# EAGLE design micromouse (EAGLE 9.6.2)
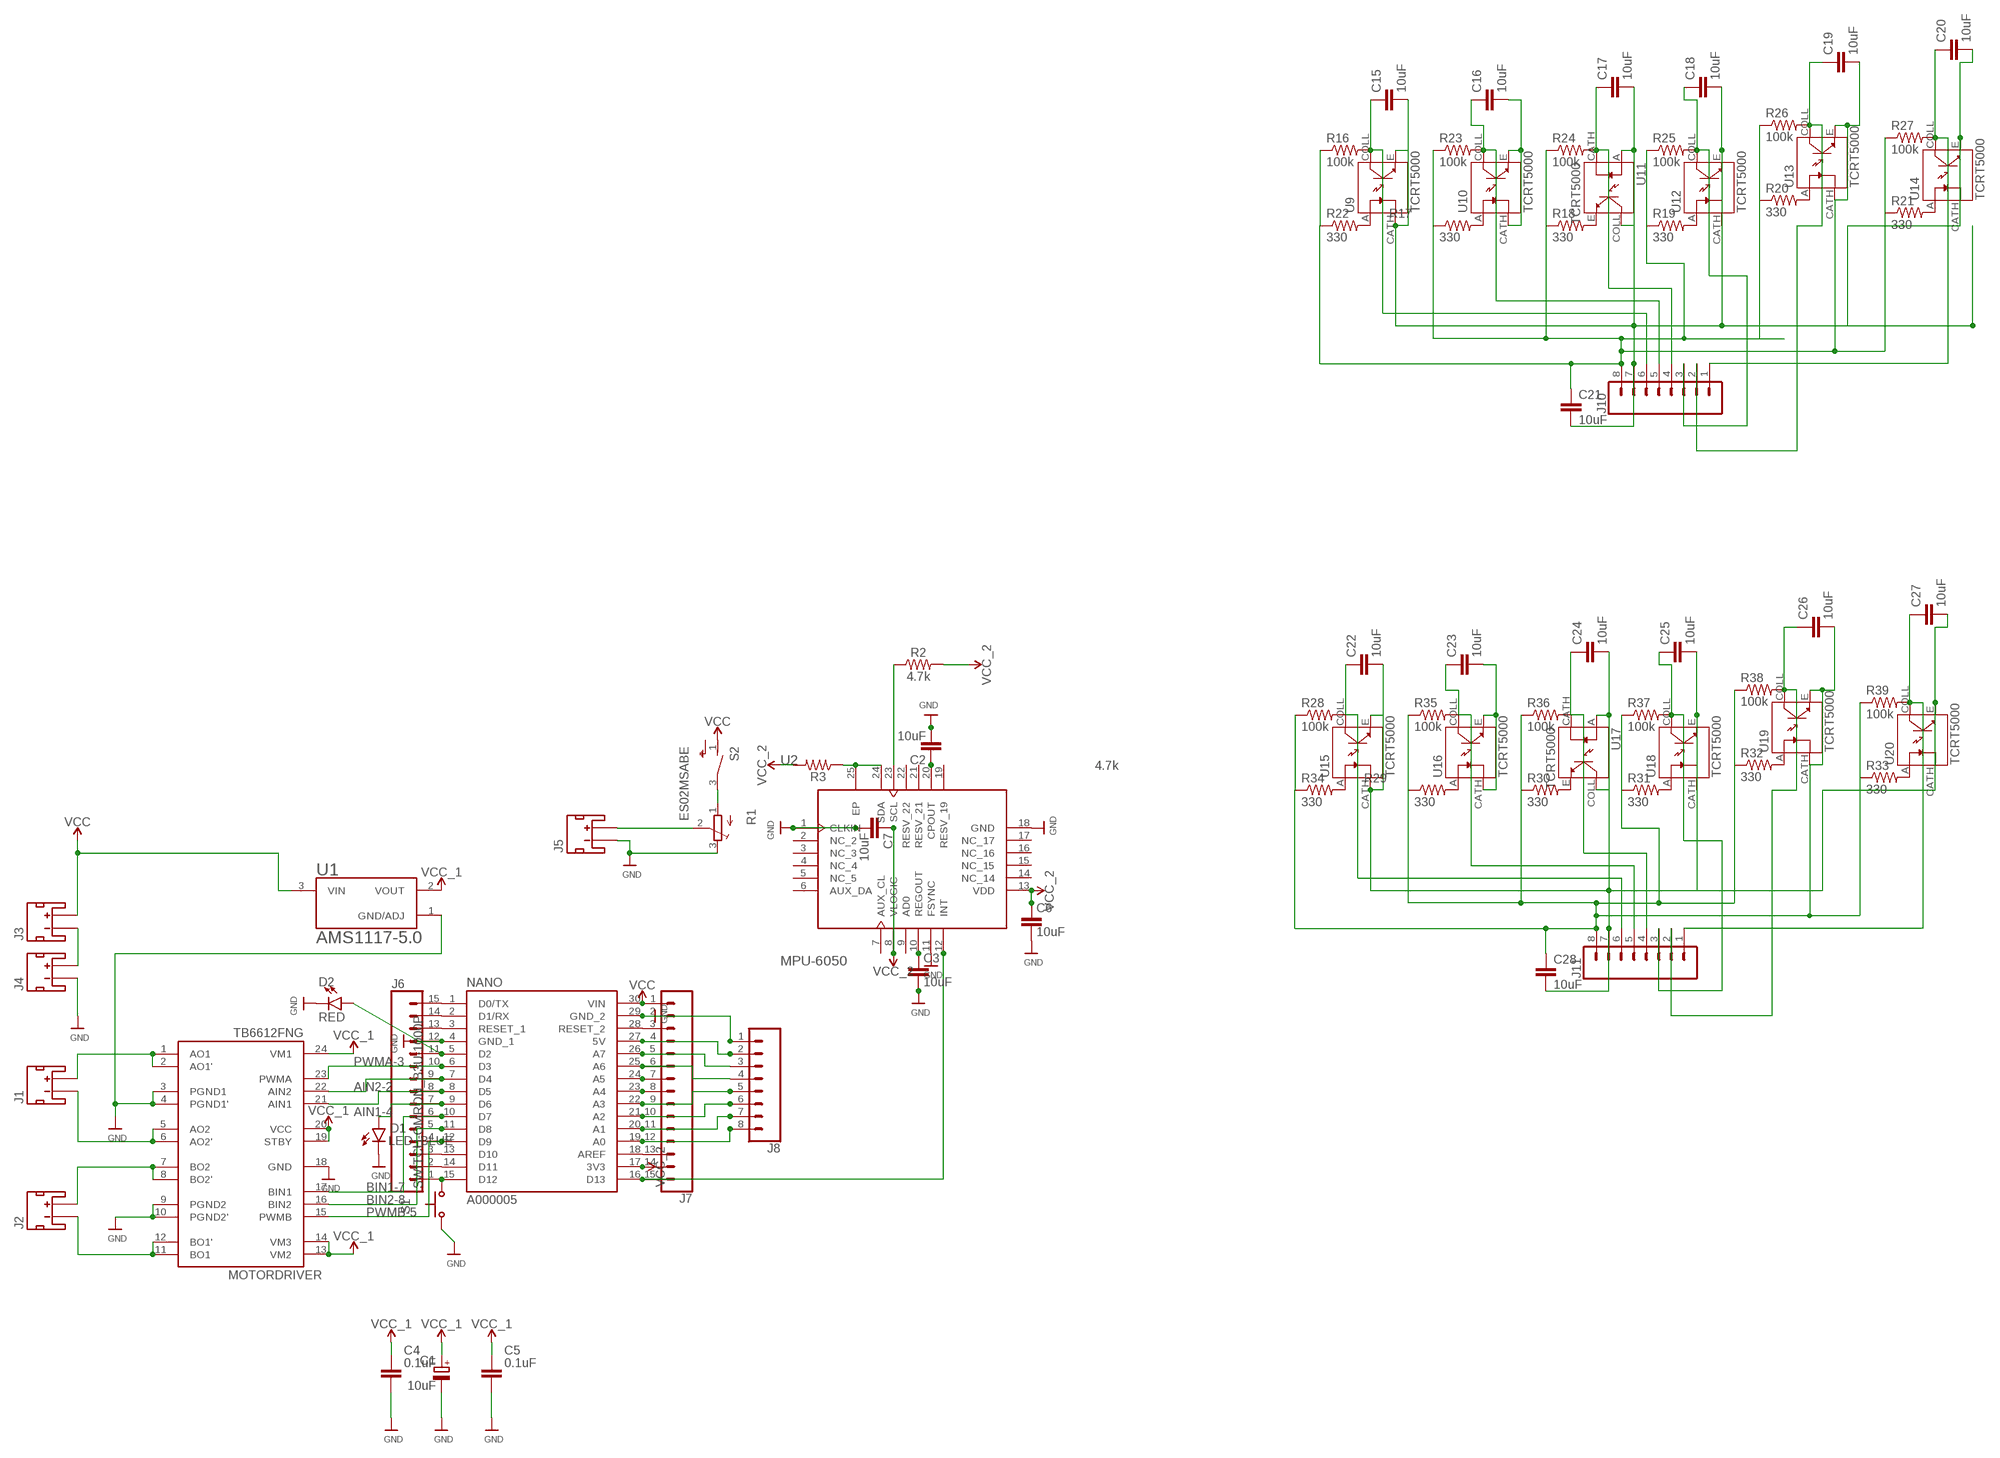
[diagram p0: schematic, sheet 1]

## Parts
C1  10uF  C-POL_TANTALUM-2917(7343-METRIC)  [CAPMP7343X310N]
C2  10uF  C0603C180J5GACTU  [CAP_0603]
C3  10uF  C0603C180J5GACTU  [CAP_0603]
C4  0.1uF  C_CHIP-1206(3216-METRIC)  [CAPC3216X135]
C5  0.1uF  C_CHIP-1206(3216-METRIC)  [CAPC3216X135]
C6  10uF  C0603C180J5GACTU  [CAP_0603]
C7  10uF  C0603C180J5GACTU  [CAP_0603]
C15  10uF  10UF-0603-6.3V-20%  [0603]
C16  10uF  10UF-0603-6.3V-20%  [0603]
C17  10uF  10UF-0603-6.3V-20%  [0603]
C18  10uF  10UF-0603-6.3V-20%  [0603]
C19  10uF  10UF-0603-6.3V-20%  [0603]
C20  10uF  10UF-0603-6.3V-20%  [0603]
C21  10uF  10UF-0603-6.3V-20%  [0603]
C22  10uF  10UF-0603-6.3V-20%  [0603]
C23  10uF  10UF-0603-6.3V-20%  [0603]
C24  10uF  10UF-0603-6.3V-20%  [0603]
C25  10uF  10UF-0603-6.3V-20%  [0603]
C26  10uF  10UF-0603-6.3V-20%  [0603]
C27  10uF  10UF-0603-6.3V-20%  [0603]
C28  10uF  10UF-0603-6.3V-20%  [0603]
D1  LED_BLUE  LED_CHIP_BLUE-1608  [LEDC1608X39N_B]
D2  RED  LED-RED1206  [LED-1206]
J1  JST_2MM_MALE  [JST-2-SMD]
J2  JST_2MM_MALE  [JST-2-SMD]
J3  JST_2MM_MALE  [JST-2-SMD]
J4  JST_2MM_MALE  [JST-2-SMD]
J5  JST_2MM_MALE  [JST-2-SMD]
J6  CONN_15LOCK  [1X15_LOCK]
J7  CONN_15LOCK  [1X15_LOCK]
J8  CONN_08NO_SILK_FEMALE_PTH  [1X08_NO_SILK]
J10  CONN_08NO_SILK_FEMALE_PTH  [1X08_NO_SILK]
J11  CONN_08NO_SILK_FEMALE_PTH  [1X08_NO_SILK]
MOTORDRIVER  TB6612FNG  [SSOP24]
NANO  A000005  [MODULE_A000005]
R1  TRIM_EU-3223W  [3223W]
R2  4.7k  4.7KOHM-0603-1/10W-1%  [0603]
R3  4.7k  4.7KOHM-0603-1/10W-1%  [0603]
R16  100k  R-US_R0603  [R0603]
R17  330  R-US_R0603  [R0603]
R18  330  R-US_R0603  [R0603]
R19  330  R-US_R0603  [R0603]
R20  330  R-US_R0603  [R0603]
R21  330  R-US_R0603  [R0603]
R22  330  R-US_R0603  [R0603]
R23  100k  R-US_R0603  [R0603]
R24  100k  R-US_R0603  [R0603]
R25  100k  R-US_MELF0207R  [MINI_MELF-0207R]
R26  100k  R-US_R0603  [R0603]
R27  100k  R-US_R0603  [R0603]
R28  100k  RESISTOR0603  [R0603]
R29  330  RESISTOR0603  [R0603]
R30  330  RESISTOR0603  [R0603]
R31  330  RESISTOR0603  [R0603]
R32  330  RESISTOR0603  [R0603]
R33  330  RESISTOR0603  [R0603]
R34  330  RESISTOR0603  [R0603]
R35  100k  RESISTOR0603  [R0603]
R36  100k  RESISTOR0603  [R0603]
R37  100k  RESISTOR0603  [R0603]
R38  100k  RESISTOR0603  [R0603]
R39  100k  RESISTOR0603  [R0603]
S1  SWITCH-OMRON_B3U-1000P  [SWITCH-OMRON_B3U-1000P]
S2  ES02MSABE  [ES02MSABE]
U1  AMS1117-5.0  [SOT229P700X180-4N]
U2  MPU-6050  [24-VFQFN]
U9  TCRT5000  [OPTO_TCRT5000]
U10  TCRT5000  [OPTO_TCRT5000]
U11  TCRT5000  [OPTO_TCRT5000]
U12  TCRT5000  [OPTO_TCRT5000]
U13  TCRT5000  [OPTO_TCRT5000]
U14  TCRT5000  [OPTO_TCRT5000]
U15  TCRT5000  [OPTO_TCRT5000]
U16  TCRT5000  [OPTO_TCRT5000]
U17  TCRT5000  [OPTO_TCRT5000]
U18  TCRT5000  [OPTO_TCRT5000]
U19  TCRT5000  [OPTO_TCRT5000]
U20  TCRT5000  [OPTO_TCRT5000]

## Nets
AIN1-4: J6.8 MOTORDRIVER.21(AIN1) NANO.8(D5)
AIN2-2: J6.9 MOTORDRIVER.22(AIN2) NANO.7(D4)
BIN1-7: J6.6 MOTORDRIVER.17(BIN1) NANO.10(D7)
BIN2-8: J6.5 MOTORDRIVER.16(BIN2) NANO.11(D8)
GND: C1.2(-) C2.2 C3.2 C4.2 C5.2 C6.2 C7.2 D1.1(C) D2.C J4.1(-) J5.1(-) J6.12 J7.2 J8.1 MOTORDRIVER.3(PGND1) MOTORDRIVER.4(PGND1') MOTORDRIVER.9(PGND2) MOTORDRIVER.10(PGND2') MOTORDRIVER.18(GND) NANO.4(GND_1) NANO.29(GND_2) R1.3(E) S1.1(P) U1.1(GND/ADJ) U2.1(CLKIN) U2.11(FSYNC) U2.18(GND)
N$1: J1.2(+) MOTORDRIVER.1(AO1) MOTORDRIVER.2(AO1')
N$2: J7.5 J8.3 NANO.26(A7)
N$3: J1.1(-) MOTORDRIVER.5(AO2) MOTORDRIVER.6(AO2')
N$4: J2.2(+) MOTORDRIVER.7(BO2) MOTORDRIVER.8(BO2')
N$5: J7.4 J8.2 NANO.27(5V)
N$6: J2.1(-) MOTORDRIVER.11(BO1) MOTORDRIVER.12(BO1')
N$7: J7.12 J8.8 NANO.19(A0)
N$8: J7.11 J8.7 NANO.20(A1)
N$9: J7.10 J8.6 NANO.21(A2)
N$10: J7.9 J8.5 NANO.22(A3)
N$11: R3.1 U2.24(SDA) U2.25(EP)
N$12: R2.1 U2.23(SCL)
N$13: R1.1(A) S2.3
N$14: D2.A J6.11 NANO.5(D2)
N$15: J5.2(+) R1.2(S)
N$16: J6.1 NANO.15(D12) S1.2(S)
N$18: J3.1(-) J4.2(+)
N$19: J6.3 NANO.13(D10)
N$20: D1.2(A) J6.7 NANO.9(D6)
N$21: J6.13 NANO.3(RESET_1)
N$22: J6.14 NANO.2(D1/RX)
N$23: J6.15 NANO.1(D0/TX)
N$24: J7.3 NANO.28(RESET_2)
N$25: J6.2 NANO.14(D11)
N$26: J7.6 J8.4 NANO.25(A6)
N$27: J7.13 NANO.18(AREF)
N$29: J7.15 NANO.16(D13) U2.12(INT)
N$30: J7.8 NANO.23(A4)
N$31: J7.7 NANO.24(A5)
N$34: C2.1 U2.20(CPOUT)
N$35: C3.1 U2.10(REGOUT)
N$47: C16.1 J10.5 R23.2 U10.COLL
N$48: C17.1 J10.4 R24.2 U11.CATH
N$49: C20.1 J10.1 R27.2 U14.COLL
N$50: C19.1 J10.2 R26.2 U13.COLL
N$51: C18.1 J10.3 R25.2 U12.COLL
N$52: R22.2 U9.A
N$53: R17.2 U10.A
N$54: C19.2 C21.1 J10.8 R16.1 R17.1 R18.1 R19.1 R20.1 R21.1 R22.1 R23.1 R24.1 R25.1 R26.1 R27.1 U13.CATH U13.E
N$55: R18.2 U11.E
N$56: C15.2 C17.2 C18.2 C20.2 C21.2 J10.7 U9.CATH U9.E U11.A U11.COLL U12.CATH U12.E U14.CATH U14.E
N$57: C16.2 U10.CATH U10.E
N$58: C15.1 J10.6 R16.2 U9.COLL
N$59: R19.2 U12.A
N$60: R20.2 U13.A
N$61: R21.2 U14.A
N$62: C23.1 J11.5 R35.2 U16.COLL
N$63: C24.1 J11.4 R36.2 U17.CATH
N$64: C27.1 J11.1 R39.2 U20.COLL
N$65: C26.1 J11.2 R38.2 U19.COLL
N$66: C25.1 J11.3 R37.2 U18.COLL
N$67: R34.2 U15.A
N$68: R29.2 U16.A
N$69: C26.2 C28.1 J11.8 R28.1 R29.1 R30.1 R31.1 R32.1 R33.1 R34.1 R35.1 R36.1 R37.1 R38.1 R39.1 U19.CATH U19.E
N$70: R30.2 U17.E
N$71: C22.2 C24.2 C25.2 C27.2 C28.2 J11.7 U15.CATH U15.E U17.A U17.COLL U18.CATH U18.E U20.CATH U20.E
N$72: C23.2 U16.CATH U16.E
N$73: C22.1 J11.6 R28.2 U15.COLL
N$74: R31.2 U18.A
N$75: R32.2 U19.A
N$76: R33.2 U20.A
PWMA-3: J6.10 MOTORDRIVER.23(PWMA) NANO.6(D3)
PWMB-5: J6.4 MOTORDRIVER.15(PWMB) NANO.12(D9)
VCC: J3.2(+) J7.1 NANO.30(VIN) S2.1 U1.3(VIN)
VCC_1: C1.1(+) C4.1 C5.1 MOTORDRIVER.13(VM2) MOTORDRIVER.14(VM3) MOTORDRIVER.19(STBY) MOTORDRIVER.20(VCC) MOTORDRIVER.24(VM1) U1.2(VOUT)
VCC_2: C6.1 C7.1 J7.14 NANO.17(3V3) R2.2 R3.2 U2.8(VLOGIC) U2.13(VDD)
Unconnected: J1.NC1(PAD1) J1.NC2(PAD2) J2.NC1(PAD1) J2.NC2(PAD2) J3.NC1(PAD1) J3.NC2(PAD2) J4.NC1(PAD1) J4.NC2(PAD2) J5.NC1(PAD1) J5.NC2(PAD2) S2.S1(SH) S2.S2(SH) U2.2(NC_2) U2.3(NC_3) U2.4(NC_4) U2.5(NC_5) U2.6(AUX_DA) U2.7(AUX_CL) U2.9(AD0) U2.14(NC_14) U2.15(NC_15) U2.16(NC_16) U2.17(NC_17) U2.19(RESV_19) U2.21(RESV_21) U2.22(RESV_22)

## Library data of the parts
C1 = Capacitor:C-POL: Capacitor Polarised - Generic; CATEGORY: Capacitor
C2 C3 C6 C7 = Resistor_Capacitor:C0603C180J5GACTU: CAP CER 18PF 50V C0G/NP0 0603 Manufacturer's datasheet; CREATED_BY: PCBLayout.com; DIGIKEY_PART_NUMBER: 399-1052-2-ND; MANUFACTURER: KEMET; MPN: C0603C180J5GACTU; PACKAGE: SMD 0603
C4 C5 = Capacitor:C: Capacitor - Generic; CATEGORY: Capacitor
C15-C28 = SparkFun-Capacitors:10UF: 10.0µF ceramic capacitors A capacitor is a passive two-terminal electrical component used to store electrical energy temporarily in an electric field.; PROD_ID: CAP-11015
D1 = Opto-Electronic:LED_CHIP: LED - Generic; CATEGORY: Opto-Electronic; COLOR: Blue; SUB-CATEGORY: LED
D2 = SparkFun-LED:LED-RED: Red SMD LED Used in manufacturing of most products at SparkFun Packages: 0603 - SMD 0603 package [Product Link] <http://docs.avagotech.com/docs/AV02-0551EN> 0603 SMART - SMD 0603 SMART package ( more efficient and expensive)[Product Link] <http://www.osram-os.com/Graphics/XPic2/00077099_0.pdf> 1206 - SMD1206 package [Product Link] <https://www.sparkfun.com/datasheets/DevTools/LilyPad/Q150OVS4.pdff> SparkFun Products: Pro Mini 328 -5V <https://www.sparkfun.com/products/821> RedBoard <https://www.sparkfun.com/products/12757> IOIO-OTG <https://www.sparkfun.com/products/13613>; PROD_ID: DIO-09912
J1-J5 = SparkFun-Connectors:JST_2MM_MALE: JST 2MM MALE RA CONNECTOR Two pin, compact surface mount connector. Commonly used as a battery input connection point. We really like the solid locking feeling and high current rating on these small connectors. We use these all the time as battery connectors. Mates to single-cell LiPo batteries. Here is the connector we sell at SparkFun: JST Right Angle Connector - White (PRT-08612) Datasheet It was used on these SparkFun products: SparkFun MOSFET Power Controller (PRT-11214) SparkFun Battery Babysitter - LiPo Battery Manager (PRT-13777) And many, many others that required a lipo battery connection.; PROD_ID: CONN-11443; SF_ID: PRT-08612
J6 J7 = SparkFun-Connectors:CONN_15: Multi connection point. Often used as Generic Header-pin footprint for 0.1 inch spaced/style header connections On any of the 0.1 inch spaced packages, you can populate with these: Break Away Headers - Straight (PRT-00116) Break Away Male Headers - Right Angle (PRT-00553) Female Headers (PRT-00115) Break Away Headers - Machine Pin (PRT-00117) Break Away Female Headers - Swiss Machine Pin (PRT-00743) For SCREWTERMINALS and SPRING TERMINALS visit here: Screw Terimnals on SparkFun.com (5mm/3.5mm/2.54mm spacing) This device is also useful as a general connection point to wire up your design to another part of your project. Our various solder wires solder well into these plated through hole pads. Hook-Up Wire - Assortment (Stranded, 22 AWG) (PRT-11375) Hook-Up Wire - Assortment (Solid Core, 22 AWG) (PRT-11367) View the entire wire category on our website here Special notes: Molex polarized connector foot print use with SKU : PRT-08231 with associated crimp pins and housings. 1MM SMD Version SKU: PRT-10208 NOTES ON THE VARIANTS LOCK and LOCK_LONGPADS... This footprint was designed to help hold the alignment of a through-hole component (i.e. 6-pin header) while soldering it into place. You may notice that each hole has been shifted either up or down by 0.005 of an inch from it's more standard position (which is a perfectly straight line). This slight alteration caused the pins (the squares in the middle) to touch the edges of the holes. Because they are alternating, it causes a "brace" to hold the component in place. 0.005 has proven to be the perfect amount of "off-center" position when using our standard breakaway headers. Although looks a little odd when you look at the bare footprint, once you have a header in there, the alteration is very hard to notice. Also,if you push a header all the way into place, it is covered up entirely on the bottom side.
J8 J10 J11 = SparkFun-Connectors:CONN_08: Multi connection point. Often used as Generic Header-pin footprint for 0.1 inch spaced/style header connections On any of the 0.1 inch spaced packages, you can populate with these: Break Away Headers - Straight (PRT-00116) Break Away Male Headers - Right Angle (PRT-00553) Female Headers (PRT-00115) Break Away Headers - Machine Pin (PRT-00117) Break Away Female Headers - Swiss Machine Pin (PRT-00743) Arduino Stackable Header - 8 Pin (PRT-09279) For SCREWTERMINALS and SPRING TERMINALS visit here: Screw Terimnals on SparkFun.com (5mm/3.5mm/2.54mm spacing) This device is also useful as a general connection point to wire up your design to another part of your project. Our various solder wires solder well into these plated through hole pads. Hook-Up Wire - Assortment (Stranded, 22 AWG) (PRT-11375) Hook-Up Wire - Assortment (Solid Core, 22 AWG) (PRT-11367) View the entire wire category on our website here Special notes: Molex polarized connector foot print use with SKU : PRT-08231 with associated crimp pins and housings. 1MM SMD Version SKU: PRT-10208 NOTES ON THE VARIANTS LOCK and LOCK_LONGPADS... This footprint was designed to help hold the alignment of a through-hole component (i.e. 6-pin header) while soldering it into place. You may notice that each hole has been shifted either up or down by 0.005 of an inch from it's more standard position (which is a perfectly straight line). This slight alteration caused the pins (the squares in the middle) to touch the edges of the holes. Because they are alternating, it causes a "brace" to hold the component in place. 0.005 has proven to be the perfect amount of "off-center" position when using our standard breakaway headers. Although looks a little odd when you look at the bare footprint, once you have a header in there, the alteration is very hard to notice. Also,if you push a header all the way into place, it is covered up entirely on the bottom side.; PROD_ID: CONN-08438
MOTORDRIVER = adafruit:TB6612FNG: TB6612FNG MOS dual H-bridge motor driver, 1.2A current 3.2A peak 3 or 5v logic and 3-15v motor
NANO = A000005:A000005: CLOCK SAW OSCILLATOR SEAM7050 T& Check availability; AVAILABILITY: In Stock; CHECK_PRICES: https://www.snapeda.com/parts/A000005/Arduino/view-part/?ref=eda; DESCRIPTION: Small, complete, and breadboard-friendly board based on the ATmega328 (Arduino Nano 3.x).; MF: Arduino; MP: A000005; PACKAGE: Non-Standard Arduino; PRICE: None; PURCHASE-URL: https://pricing.snapeda.com/search?q=A000005&ref=eda; SNAPEDA_LINK: https://www.snapeda.com/parts/A000005/Arduino/view-part/?ref=snap
R1 = pot:TRIM_EU-: POTENTIOMETER
R2 R3 = SparkFun-Resistors:4.7KOHM: 4.7kΩ resistor A resistor is a passive two-terminal electrical component that implements electrical resistance as a circuit element. Resistors act to reduce current flow, and, at the same time, act to lower voltage levels within circuits. - Wikipedia; PROD_ID: RES-07857
R16-R27 = BeagleBone_Black_Wireless:R-US_: RESISTOR, American symbol
R28-R39 = BeagleBone_Blue_R3:RESISTOR
S1 = LinkedLibrary52101:SWITCH-OMRON_B3U-1000P: SMD Tactile Switch - Ultra Small
S2 = Switch:ES02MSABE: SWITCH SLIDE SPST 0.4VA 20V Manufacturer's datasheet; CREATED_BY: PCBLayout.com; DIGIKEY_PARTNO: CKN1813TR-ND; MANUFACTURER: C&K; MPN: ES02MSABE
U1 = AMS1117-5.0:AMS1117-5.0: Check availability; AVAILABILITY: Not in stock; CHECK_PRICES: https://www.snapeda.com/parts/AMS1117-5.0/Advanced+Monolithic+Systems/view-part/?ref=eda; DESCRIPTION: Sot223/Pkg 1-Amp 5-Volt Low Drop Out Voltage Regulatator; MF: Advanced Monolithic Systems; MP: AMS1117-5.0; PACKAGE: SOT-223 Seeed Technology; PRICE: None; SNAPEDA_LINK: https://www.snapeda.com/parts/AMS1117-5.0/Advanced+Monolithic+Systems/view-part/?ref=snap
U2 = Sensor:MPU-6050: IMU ACCEL/GYRO 3-AXIS I2C 24QFN Manufacturer's datasheet; CREATED_BY: PCBLayout.com; DIGIKEY_PART_NUMBER: 1428-1007-1-ND; MANUFACTURER: TDK InvenSense; MPN: MPU-6050; PACKAGE: 24-VFQFN
U9-U20 = TCRT5000:TCRT5000: 950 nm 60 mA Through Hole Reflective Optical Sensor with Transistor Output Check availability; AVAILABILITY: In Stock; CHECK_PRICES: https://www.snapeda.com/parts/TCRT5000/Vishay+Semiconductor+Opto+Division/view-part/?ref=eda; DESCRIPTION: Reflective Optical Sensor 0.591 (15mm) PCB Mount; MF: Vishay; MP: TCRT5000; PACKAGE: TCRT5000 Vishay; PRICE: None; PURCHASE-URL: https://www.snapeda.com/api/url_track_click_mouser/?unipart_id=885229&manufacturer=Vishay&part_name=TCRT5000&search_term=None; SNAPEDA_LINK: https://www.snapeda.com/parts/TCRT5000/Vishay+Semiconductor+Opto+Division/view-part/?ref=snap

## Module BODY
Ports: 

### Library data of the parts

## Board
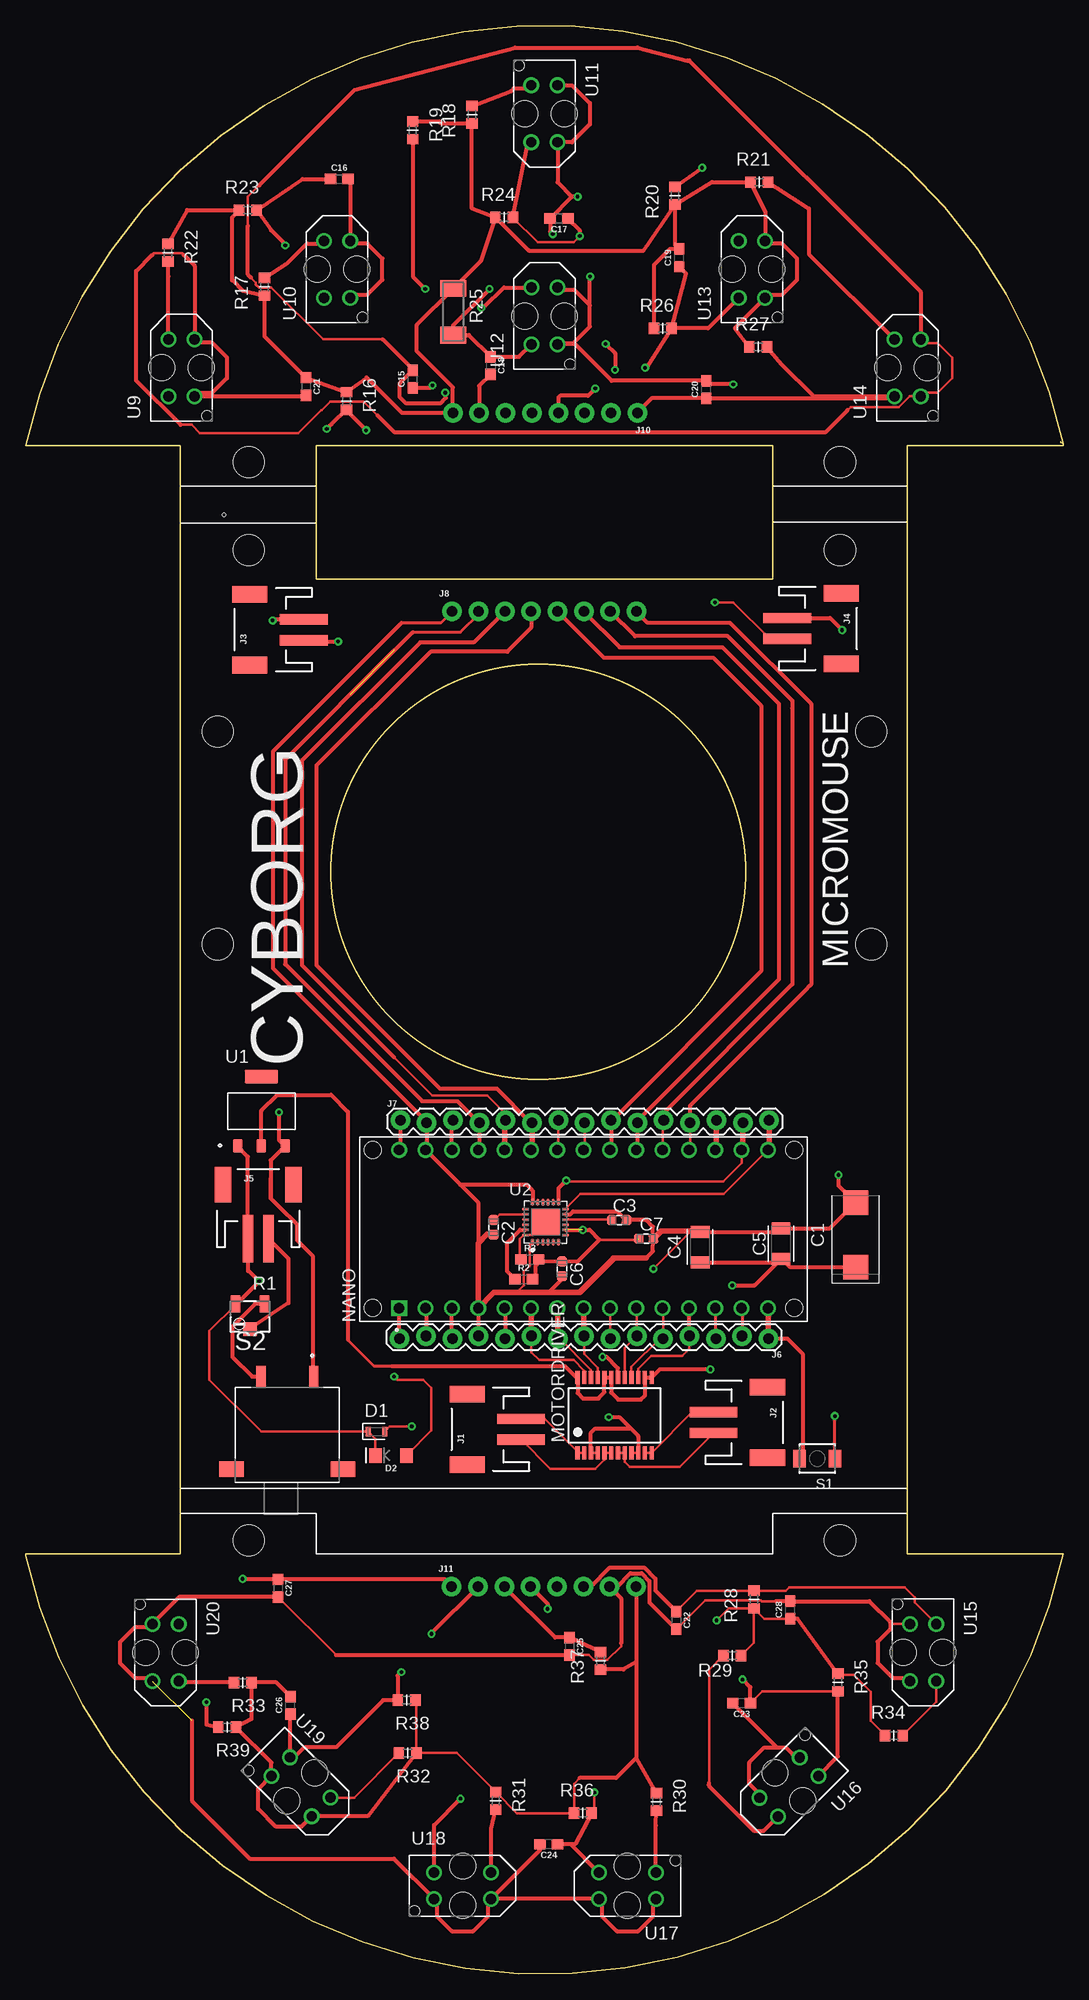
[diagram p1: board, top side]
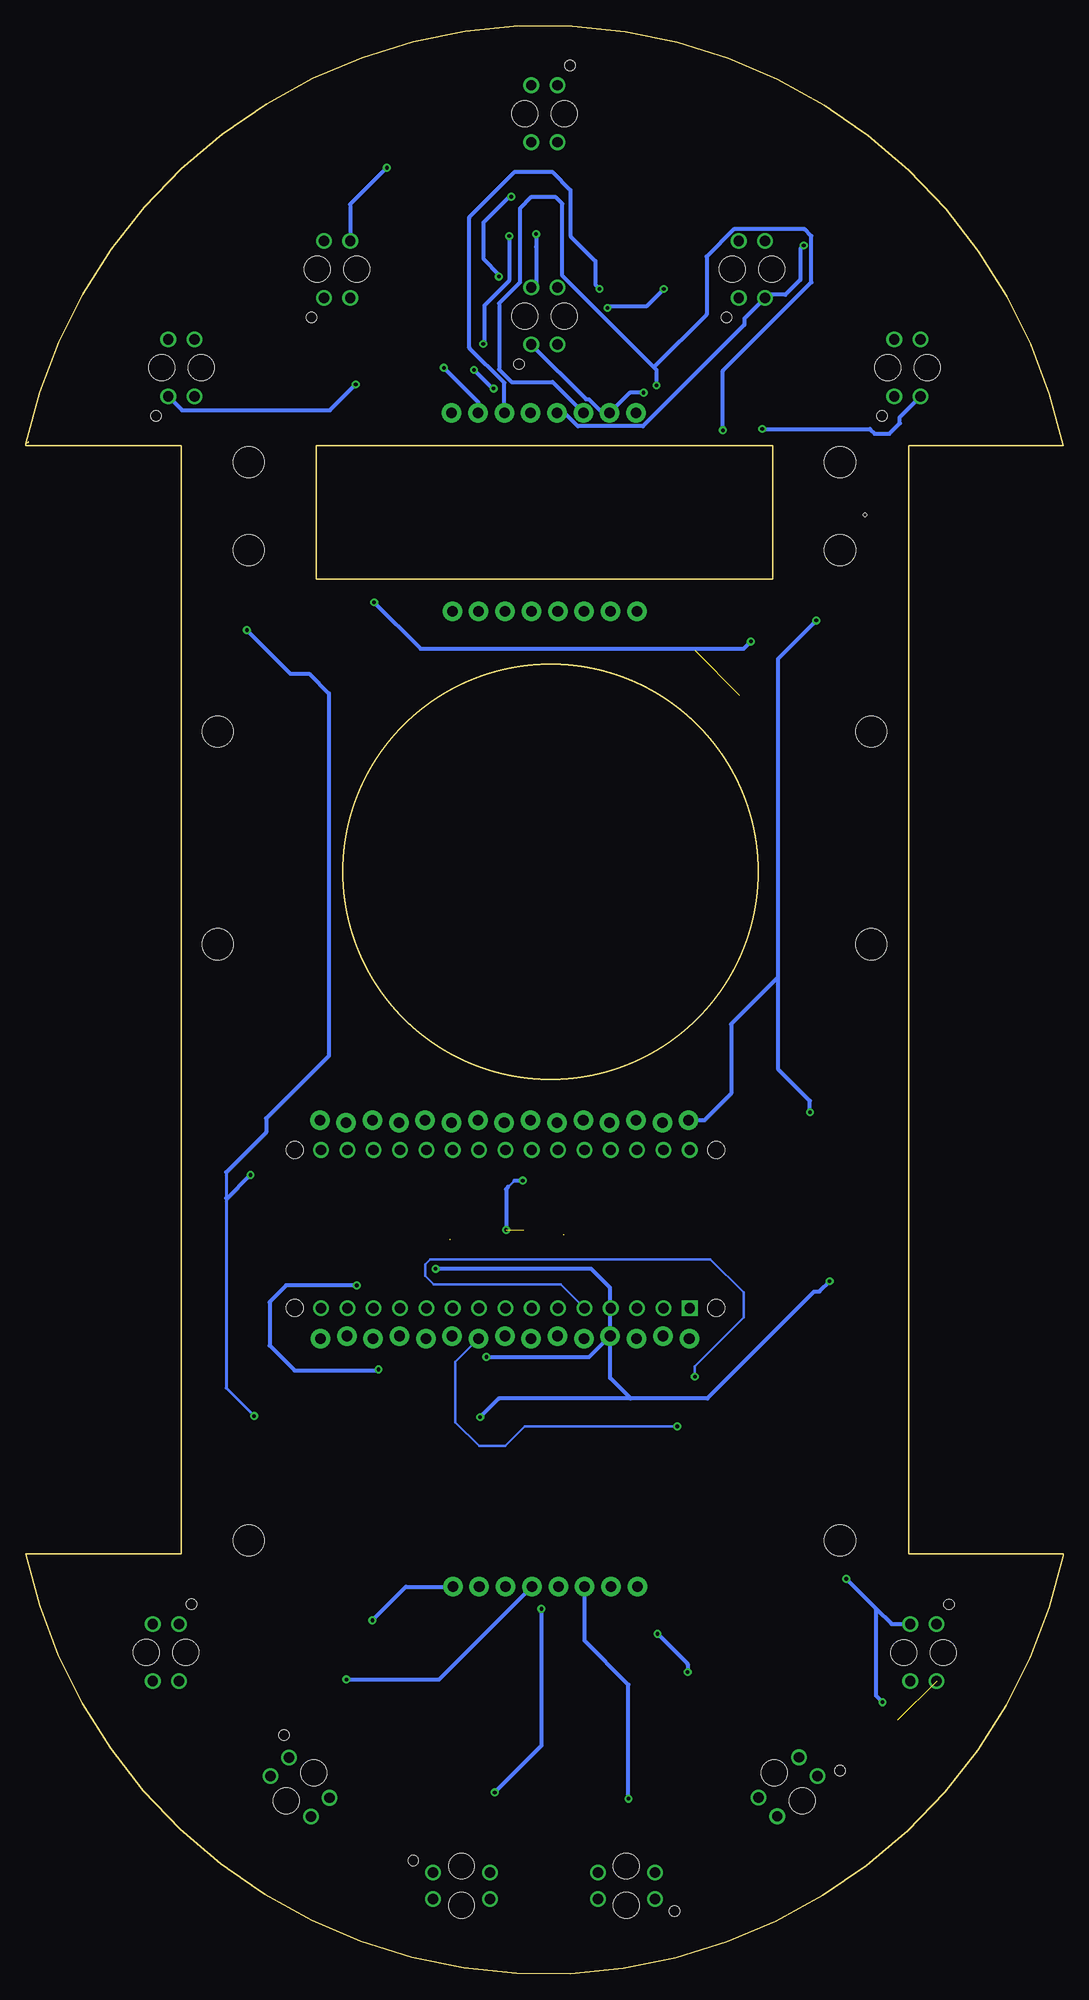
[diagram p2: board, bottom side, seen from below]

Size 100 x 187.84 mm. Coordinates in mm from the lower left corner, seen from the top.
Outline: 100,147.57 100,147.37 85,147.37 85,40.47 100,40.47 arc-156 0,40.27 0,40.47 14.9,40.47 14.9,147.37 0,147.37 arc-156 100,147.57
Outline: 100,147.57 99.8,147.67 99.8,147.77
Outline: 28,134.47 72,134.47 72,147.37 28,147.37 28,134.47
Outline: circle at 49.4,106.27 radius 20
Copper layers (1*16): Top 0.035mm / dielectric 1.5mm / Bottom 0.035mm
Design rules "default": minimum track width 6mil, minimum drill 0.35mm, track to track 6mil, track to pad 6mil, pad to pad 6mil, via to via 6mil, smd to smd 6mil, copper to edge 40mil, drill to drill 6mil, minimum pad ring 10mil, minimum via ring 8mil, stop-mask expansion 4mil, vias tented up to drill 0mil, thermal gap 10mil
Holes 40 mm at 49.4,106.27 49.4,106.27
Holes 3 mm at 18.5,119.77 81.5,119.77 18.5,99.27 81.5,99.27 78.5,137.27 21.5,137.27 21.5,145.77 78.5,145.77 21.5,41.77 78.5,41.77
Holes 0.35 mm at 19.1,140.67

### Footprints (pad centres in the part's own frame; a part is rotated, then mirrored left to right if it is on the bottom)
CAPMP7343X310N = smd 2.368 x 2.404: 1 -3.121,0; 2 3.121,0
CAP_0603 = smd 0.92 x 0.93: 1 -0.705,0; 2 0.705,0
CAPC3216X135 = smd 1.165 x 1.815: 1 -1.475,0; 2 1.475,0
0603 = smd 1.1 x 1: 1 -0.85,0; 2 0.85,0
LEDC1608X39N_B = smd 0.512 x 0.912: 1 -0.8,0; 2 0.8,0
LED-1206 = smd 1.2 x 1.4: A -1.5,0; C 1.5,0
JST-2-SMD = smd 1 x 4.6: 1 -1,-3.7; 2 1,-3.7 | smd 1.6 x 3.4: NC1 -3.4,1.5; NC2 3.4,1.5
1X15_LOCK = drill 1.016 pad 1.88: 1 0,0.127; 2 2.54,-0.127; 3 5.08,0.127; 4 7.62,-0.127; 5 10.16,0.127; 6 12.7,-0.127; 7 15.24,0.127; 8 17.78,-0.127; 9 20.32,0.127; 10 22.86,-0.127; 11 25.4,0.127; 12 27.94,-0.127; 13 30.48,0.127; 14 33.02,-0.127; 15 35.56,0.127
1X08_NO_SILK = drill 1.016 pad 1.88: 1 0,0; 2 2.54,0; 3 5.08,0; 4 7.62,0; 5 10.16,0; 6 12.7,0; 7 15.24,0; 8 17.78,0
SSOP24 = smd 0.4 x 1.25: 1 -3.575,-3.625; 2 -2.925,-3.625; 3 -2.275,-3.625; 4 -1.625,-3.625; 5 -0.975,-3.625; 6 -0.325,-3.625; 7 0.325,-3.625; 8 0.975,-3.625; 9 1.625,-3.625; 10 2.275,-3.625; 11 2.925,-3.625; 12 3.575,-3.625; 13 3.575,3.625; 14 2.925,3.625; 15 2.275,3.625; 16 1.625,3.625; 17 0.975,3.625; 18 0.325,3.625; 19 -0.325,3.625; 20 -0.975,3.625; 21 -1.625,3.625; 22 -2.275,3.625; 23 -2.925,3.625; 24 -3.575,3.625
MODULE_A000005 = drill 1 square: 1 -7.62,17.78 | drill 1: 2 -7.62,15.24; 3 -7.62,12.7; 4 -7.62,10.16; 5 -7.62,7.62; 6 -7.62,5.08; 7 -7.62,2.54; 8 -7.62,0; 9 -7.62,-2.54; 10 -7.62,-5.08; 11 -7.62,-7.62; 12 -7.62,-10.16; 13 -7.62,-12.7; 14 -7.62,-15.24; 15 -7.62,-17.78; 16 7.62,-17.78; 17 7.62,-15.24; 18 7.62,-12.7; 19 7.62,-10.16; 20 7.62,-7.62; 21 7.62,-5.08; 22 7.62,-2.54; 23 7.62,0; 24 7.62,2.54; 25 7.62,5.08; 26 7.62,7.62; 27 7.62,10.16; 28 7.62,12.7; 29 7.62,15.24; 30 7.62,17.78 | hole 1.651: -7.62,-20.32; 7.62,-20.32; -7.62,20.32; 7.62,20.32
3223W = smd 0.9 x 1.6: 1 -1.4,-1.215; 3 1.4,-1.215 | smd 1.3 x 1.3: 2 0,1.215
R0603 = smd 1 x 1.1: 1 -0.85,0; 2 0.85,0
MINI_MELF-0207R = smd 1.6 x 2.5: 1 -2.25,0; 2 2.25,0
SWITCH-OMRON_B3U-1000P = smd 1.2 x 1.7: 1 -1.7,0; 2 1.7,0
ES02MSABE = smd 0.89 x 2.08: 1 2.54,0; 3 -2.54,0 | smd 2.325 x 1.52: S1 5.378,-8.92; S2 -5.378,-8.92
SOT229P700X180-4N = smd 0.93 x 1.31: 1 -2.29,-3.345; 2 0,-3.345; 3 2.29,-3.345 | smd 3.24 x 1.31: 4 0,3.345
24-VFQFN = smd 0.26 x 0.69: 1 -1.25,-1.92; 2 -0.75,-1.92; 3 -0.25,-1.92; 4 0.25,-1.92; 5 0.75,-1.92; 6 1.25,-1.92; 13 1.25,1.92; 14 0.75,1.92; 15 0.25,1.92; 16 -0.25,1.92; 17 -0.75,1.92; 18 -1.25,1.92 | smd 0.69 x 0.26: 7 1.92,-1.25; 8 1.92,-0.75; 9 1.92,-0.25; 10 1.92,0.25; 11 1.92,0.75; 12 1.92,1.25; 19 -1.92,1.25; 20 -1.92,0.75; 21 -1.92,0.25; 22 -1.92,-0.25; 23 -1.92,-0.75; 24 -1.92,-1.25 | smd 2.7 x 2.6: 25 0,0
OPTO_TCRT5000 = drill 1 pad 1.5: A 2.75,1.27; CATH 2.75,-1.27; COLL -2.75,1.27; E -2.75,-1.27 | hole 1: -4.65,-2.45 | hole 2.5: 0,-1.9; 0,1.9

### Placement (x,y rotation side)
C1  80,71.23 90 top
C2  45.1,71.97 270 top
C3  57.2,72.67 0 top
C4  65.01,70.07 90 top
C5  72.81,70.39 90 top
C6  51.7,67.97 270 top
C7  59.8,70.87 0 top
C15  37.3,153.77 90 top
C16  30.2,173.07 0 top
C17  51.4,169.27 180 top
C18  44.8,155.07 270 top
C19  63,165.47 90 top
C20  65.6,152.77 90 top
C21  27,153.07 270 top
C22  62.7,34.07 270 top
C23  69,26.07 180 top
C24  50.4,12.47 180 top
C25  52.4,31.57 270 top
C26  25.5,25.87 90 top
C27  24.3,37.17 270 top
C28  73.7,35.07 90 top
D1  33.8,52.27 0 top
D2  35.2,49.97 180 top
J1  44.05,52.5 90 top
J2  70.01,53.15 270 top
J3  23.09,129.6 90 top
J4  77.11,129.73 270 top
J5  22.4,74.57 0 top
J6  71.6,61.37 180 top
J7  36.1,82.17 0 top
J8  41.1,131.37 0 top
J10  58.95,150.53 180 top
J11  41.05,37.31 0 top
MOTORDRIVER  56.76,53.85 0 top
NANO  53.77,71.81 90 top
R1  21.6,63.37 180 top
R2  48,66.97 0 top
R3  48.6,68.87 0 top
R16  30.9,151.67 270 top
R17  23,162.67 90 top
R18  43,179.27 90 top
R19  37.3,177.77 270 top
R20  62.6,171.47 90 top
R21  70.7,172.77 0 top
R22  13.7,165.97 270 top
R23  21.4,170.07 0 top
R24  46.1,169.37 0 top
R25  41.2,160.27 270 top
R26  61.4,158.67 0 top
R27  70.6,156.87 0 top
R28  70.2,36.07 90 top
R29  68.1,30.67 180 top
R30  60.8,16.57 270 top
R31  45.3,16.67 270 top
R32  36.8,21.27 180 top
R33  20.9,28.07 180 top
R34  83.7,22.97 0 top
R35  78.3,28.07 270 top
R36  53.7,15.47 0 top
R37  55.4,30.17 90 top
R38  36.7,26.37 180 top
R39  19.4,23.77 180 top
S1  76.3,49.67 180 top
S2  25.2,57.57 0 top
U1  22.7,83.17 0 top
U2  50.1,72.47 0 top
U9  15,154.87 90 top
U10  30,164.37 90 top
U11  50,179.37 270 top
U12  50,159.87 90 top
U13  70,164.37 90 top
U14  85,154.86 90 top
U15  86.5,30.97 270 top
U16  73.57,18 225 top
U17  58,8.47 180 top
U18  42.1,8.47 0 top
U19  26.51,18.02 315 top
U20  13.46,30.96 270 top

### Tracks (layer width: path | path; a pad name or v marks a point on that pad's centre or on a via)
AIN1-4
  Top 0.254: J6.8 53.82,59.75 55.13,58.44 MOTORDRIVER.21
  Top 0.508: NANO.8 53.77,61.55 J6.8
AIN2-2
  Top 0.254: J6.9 51.48,61.25 54.48,58.24 MOTORDRIVER.22
  Top 0.508: J6.9 51.28,64.14 NANO.7
BIN1-7
  Top 0.254: MOTORDRIVER.17 57.73,60.33 J6.6 58.9,64.14 NANO.10
BIN2-8
  Top 0.254: NANO.11 61.44,64.14 J6.5 61.14,61.25 58.38,58.49 MOTORDRIVER.16
GND  (via drill 0.35)
  Top 0.254: MOTORDRIVER.3 MOTORDRIVER.4 | MOTORDRIVER.9 MOTORDRIVER.10 | MOTORDRIVER.3 54.5,50.24 54.5,52.17 54.9,52.57 | 43.61,61.55 J6.12 | MOTORDRIVER.3 54.41,50.16 | C3.2 57.61,72.92 | C3.2 58.08,72.9 | 47.6,65.67 47.6,65.97 48.02,66.39 48.02,67.7 48.58,68.26 48.58,70.28 U2.1 | C3.2 57,73.52 | 58,72.67 C3.2 | 48.75,75.62 48.85,75.52 | 64.7,71.55 C4.2 64.08,71.55 v60.5,67.97 | 20.32,64.59 17.7,61.97 17.7,57.27 22.7,52.27 D1.1 33.7,51.57 D2.C
  Top 0.305: S1.1 v78,53.77 | 36.2,130.27 40,130.27 J8.1
  Top 0.406: 75.14,130.73 J4.1 77.54,130.73 v78.7,129.57 | 72.9,71.87 77.51,71.87 C1.2 78.92,75.43 78.92,75.45 78.35,76.02 v78.35,77.02 | NANO.4 43.61,64.17 43.61,61.55 | MOTORDRIVER.3 54.48,52.16 54.9,52.57 58.3,52.57 | 58.3,52.57 59.03,51.84 MOTORDRIVER.10 | J5.1 21.4,78.77 20.41,79.76 U1.1 | J5.1 21.4,67.72 | 36.2,130.27 23.8,117.88 23.8,96.98 38.64,82.15 J7.2 38.64,79.54 NANO.29 41.87,76.09 | R1.3 20.32,64.59 v22.5,66.77 21.4,67.87 J5.1 | v56.2,53.67 57.2,53.67 58.3,52.57 | MOTORDRIVER.18 57.09,58.39 56,59.47 v55.6,59.47 | 41.87,76.09 48.28,76.09 48.75,75.62 | 48.85,75.52 U2.18 | 41.87,76.09 43.61,74.35 43.61,70.43 | 59.8,69.02 60.45,69.67 C7.2 60.45,72.02 59.8,72.67 58,72.67 | U2.11 52.03,73.24 52.47,73.24 52.76,73.52 57,73.52 57.04,73.48 57.05,73.48 57.26,73.27 C3.2 | C6.2 51.7,66.97 50.4,65.67 | C4.2 72.58,71.55 72.9,71.87 | C5.2 72.9,71.87
  Top 0.508: C7.2 61.25,71.62 64.48,71.62 | 56.7,69.02 59.8,69.02 | 56.7,69.02 56.65,69.02 | 56.7,69.02 56.7,68.97 53.4,65.67 50.4,65.67 47.6,65.67 45.11,65.67 43.61,64.17 43.61,70.43 44.5,71.32 C2.2
  Bottom 0.305: 80.7,77.27 80.7,74.77 80.7,56.47 v78,53.77
  Bottom 0.406: v78.7,129.57 74.5,125.37 72.7,125.37 70.8,123.47 70.8,88.51 76.84,82.48 76.84,81.14 80.7,77.27 | 80.7,74.77 80.65,74.72 v78.35,77.02 | v22.5,66.77 23.5,65.77 24,65.77 34.3,55.47 41.7,55.47 | 41.7,55.47 43.66,57.43 J6.12 | 41.7,55.47 54.4,55.47 v56.2,53.67 | v55.6,59.47 45.69,59.47 J6.12 | J6.12 43.66,66.13 45.5,67.97 v60.5,67.97
N$1
  Top 0.254: MOTORDRIVER.1 53.3,50.23 | 53.3,50.23 MOTORDRIVER.2 | J1.2 50.02,53.5 53.3,50.23
N$2
  Top 0.254: J7.5 46.26,82.91 44.5,84.67 39.2,84.67 35.5,88.37
  Top 0.406: J8.3 43.18,128.37 38,128.37 26.6,116.97 26.6,97.27 35.5,88.37
  Top 0.508: NANO.26 46.15,82.19 J7.5
N$3
  Top 0.254: MOTORDRIVER.6 MOTORDRIVER.5 55.78,49.56 54.9,48.67 50.58,48.67 J1.1
N$4
  Top 0.254: MOTORDRIVER.7 MOTORDRIVER.8 57.73,49.34 58.2,48.87 63.03,48.87 J2.2
N$5  (1 unrouted)
  Top 0.305: 37.3,129.37 41.9,129.37 43.64,131.11 J8.2
  Top 0.406: 31.24,123.31 37.3,129.37 | NANO.27 43.72,79.54 J7.4 41.61,84.15 38.21,84.15 25,97.36 25,117.11 35.52,127.62
N$6
  Top 0.254: MOTORDRIVER.11 MOTORDRIVER.12 64.26,54.15 J2.1
N$7
  Top 0.254: J7.12 64.04,79.54 NANO.19
  Top 0.406: J8.8 59.98,130.27 67.9,130.27 75.7,122.47 75.7,95.37 75.6,95.27 75.25,94.92 64.04,83.71 J7.12
N$8
  Top 0.254: J7.11 61.5,82.47 61.39,82.36 NANO.20 | 73.9,121.95 73.8,122.05
  Top 0.406: J7.11 61.5,83.02 73.9,95.42 73.9,121.95 73.9,122.77 73.89,122.76 67.68,128.97 58.74,128.97 J8.7
N$9
  Top 0.254: 58.96,82.27 J7.10
  Top 0.406: J8.6 57.26,127.92 67.16,127.92 72.6,122.47 72.6,95.89 58.99,82.27 58.96,82.27 | J7.10 58.96,79.54 NANO.21
N$10
  Top 0.406: J8.5 55.73,126.9 66.28,126.9 70.89,122.29 70.89,96.67 56.52,82.3 J7.9 56.42,79.54 NANO.22
N$11  (1 unrouted)
  Top 0.254: R3.1 47.6,69.02 47.6,70.84 47.98,71.22 U2.24 | U2.25 48.85,71.23 48.08,71.23
N$12
  Top 0.254: 46.9,66.97 R2.1
  Top 0.406: R2.1 46.4,67.72 46.4,70.47 47.65,71.72 U2.23
N$13
  Top 0.406: R1.1 22.1,64.59 19.9,62.39 19.9,59.47 21.8,57.57 S2.3
N$14  (via drill 0.35)
  Top 0.254: D2.A 39.1,52.37 39.1,56.47 38.3,57.27 35.8,57.27 v35.5,57.57
  Top 0.406: NANO.5 46.2,64.14 J6.11
  Bottom 0.254: v35.5,57.57 35.5,58.57 30.8,63.27 30.8,65.67 34,68.87 61,68.87 61.5,68.37 61.5,67.27 60.7,66.47 48.43,66.47 NANO.5
N$15
  Top 0.406: J5.2 25.3,68.97 25.3,64.67 R1.2
N$16
  Top 0.406: J6.1 73.43,61.25 74.9,59.77 74.9,49.97 S1.2
  Top 0.508: J6.1 71.6,64.14 NANO.15
N$18  (via drill 0.35)
  Top 0.254: J4.2 71.71,128.73 68.19,132.25 v66.42,132.25
  Top 0.406: J3.1 26.79,128.47 v30.1,128.47
  Bottom 0.406: v66.42,132.25 61.95,127.77 30.8,127.77 v30.1,128.47
N$19
  Top 0.305: J6.3 66.52,64.14 NANO.13
N$20  (via drill 0.35)
  Top 0.254: J6.7 56.36,64.14 NANO.9 | D1.2 35.1,52.77 v37.2,52.77
  Bottom 0.254: v37.2,52.77 51.9,52.77 53.8,50.87 56.3,50.87 58.6,53.17 58.6,59.01 J6.7
N$21
  Top 0.254: 41.07,64.07 NANO.3
  Top 0.406: J6.13 41.07,61.3 41.07,64.07
N$22
  Top 0.406: NANO.2 38.58,64.14 J6.14
N$23
  Top 0.406: J6.15 35.99,61.3 NANO.1
N$24
  Top 0.406: NANO.28 41.07,82.19 J7.3
N$25
  Top 0.305: NANO.14 69.06,64.14 J6.2
N$26
  Top 0.406: J8.4 48.72,129.79 46.42,127.49 39.01,127.49 28,116.49 28,97.26 39.91,85.35 45.39,85.35 48.7,82.05 J7.6 48.3,82.05
  Top 0.508: J7.6 48.8,79.54 NANO.25
N$27
  Top 0.508: J7.13 66.58,79.54 NANO.18
N$29
  Top 0.254: U2.12 53.47,75.17 67.29,75.17 NANO.16
  Top 0.508: J7.15 71.66,79.54 NANO.16
N$30
  Top 0.254: J7.8 53.87,79.53 NANO.23
N$31
  Top 0.254: J7.7 51.34,79.54 NANO.24
N$34
  Top 0.254: C2.1 45.7,73.22 U2.20
N$35
  Top 0.254: C3.1 56.5,72.72 U2.10
N$47  (via drill 0.35)
  Top 0.406: v25,166.67 25,166.77 23.65,168.12 R23.2 26.65,173.07 C16.1
  Bottom 0.406: J10.5 48.08,150.53 46.79,149.24 40.51,149.24 30.73,159.01 30.73,159.62 U10.COLL 28.45,161.9 26.78,161.9 25.33,163.35 25.33,166.34 v25,166.67
N$48  (via drill 0.35)
  Top 0.254: R24.2 49.35,166.97 52.8,166.97 v53.4,167.57
  Top 0.406: R24.2 48.35,176.24 U11.CATH | C17.1 53.4,168.12 v53.4,167.57 | v55.9,157.17 56.8,156.27 v56.8,154.67 | v54.9,152.87 54.2,152.17 51.5,152.17 51.33,152 J10.4
  Bottom 0.406: v53.4,167.57 53.4,163.27 55.8,160.87 55.8,157.27 v55.9,157.17 | v56.8,154.67 55,152.87 v54.9,152.87
N$49
  Top 0.406: R27.2 72.85,155.22 75.96,152.11 U14.COLL 83.54,151.92 C20.1 60.34,151.92 J10.1
N$50  (via drill 0.35)
  Top 0.406: R26.2 63.65,163.97 C19.1 | U13.COLL 65.79,158.67 R26.2 | R26.2 59.85,154.87 v59.7,154.87
  Bottom 0.406: v59.7,154.87 56.41,151.58 J10.2
N$51  (via drill 0.35)
  Top 0.406: v44.7,162.47 41.2,158.97 R25.2 42.7,158.02 C18.1 47.53,155.92 U12.COLL
  Bottom 0.406: J10.3 53.87,153.42 57.23,156.78 57.23,169.38 52.84,173.77 49.27,173.77 47.51,172.01 47.51,167.58 45.1,165.17 45.1,162.87 v44.7,162.47
N$52
  Top 0.406: U9.A 13.73,163.69 R22.2
N$53
  Top 0.406: U10.A 28.45,166.84 27.08,166.84 25.16,164.92 R17.2
N$54
  Top 0.406: R22.1 15.55,170.07 R23.1 19.85,169.37 19.85,163.32 19.92,163.3 20.95,162.27 22.81,161.82 R17.1 23,157.92 C21.1 R16.1 32.85,153.92 36.24,150.53 J10.8 41.17,153 37.7,156.47 37.7,159.02 R25.1 43.85,165.17 R24.1 | R24.1 43,170.22 R18.1 40,178.42 39.9,178.62 R19.1 | R24.1 45.65,168.97 45.7,168.97 48.5,166.17 59.55,166.17 R20.1 | R26.1 60.55,164.77 62.1,166.32 C19.2 62.6,166.72 R20.1 | R20.1 66.15,172.77 R21.1 71.27,169.95 71.27,167.27 | 71.27,167.27 U13.CATH | 71.27,167.27 71.71,166.84 72.93,166.84 74.37,165.39 74.37,163.35 72.93,161.9 71.55,161.9 U13.E 68.35,158.7 R27.1
N$55
  Top 0.406: R18.2 46.76,181.52 47.08,181.84 48.45,181.84 U11.E
N$56  (via drill 0.35)
  Top 0.254: 12.2,165.77 12.33,165.9 15.07,165.9 15.2,165.77 | 21.39,168.57 21.39,171.37 22.5,172.47 | 21.7,163.57 22.17,163.1 22.17,162.91 22.48,162.6 23.67,162.6 28.64,157.62 34.4,157.62 | 33.9,150.27 32.57,151.6 29.33,151.6 28.52,150.79 28.48,150.79 26.27,148.58 16.77,148.58 15.97,149.38 14.91,149.38 | 79.23,150.8 79.51,151.08 84.16,151.08 85.2,152.11 U14.E 86.63,152.47 87.9,152.47 89.3,153.87 89.3,155.85 87.9,157.26 86.63,157.26 U14.CATH
  Top 0.406: 54.37,160.9 54.37,158.85 52.73,157.2 51.35,157.2 U12.E 51.47,157.12 51.49,157.14 52.96,157.14 56.48,153.62 C20.2 65.95,153.27 v68.2,153.27 | 54.37,160.9 52.92,162.34 51.55,162.34 U12.CATH | 54.37,160.9 54.37,163.67 v54.4,163.67 | v53.2,171.37 52.65,171.37 | 52.65,171.37 C17.2 50.55,168.02 v50.8,167.77 | U11.COLL 52.64,182.12 54.37,180.4 54.37,178.35 52.64,176.62 U11.A 51.27,172.75 52.65,171.37 | C18.2 43.71,153.13 J10.7 | 34.4,157.62 37.3,154.72 C15.2 36,153.32 36,152.07 36.6,151.47 40,151.47 40.5,151.97 40.5,152.47 v40.44,152.47 | 14.91,149.38 10.63,153.65 10.63,164.21 12.2,165.77 | 15.2,165.77 16.27,164.71 U9.CATH 16.55,157.34 17.92,157.34 19.37,155.9 19.37,153.85 17.92,152.4 16.55,152.4 U9.E 26.9,152.12 C21.2 | 21.7,163.57 21.39,163.88 21.39,168.57 | 22.5,172.47 31.7,181.68 47.16,185.74 58.99,185.74 63.77,184.51 63.96,184.51 86.28,162.2 U14.CATH | 79.23,150.8 77.1,148.67 35.5,148.67 33.9,150.27
  Bottom 0.406: v54.4,163.67 54.4,163.87 55.9,165.37 55.9,168.87 53.4,171.37 v53.2,171.37 | v50.8,167.77 50.8,166.53 50.77,166.5 50.77,163.12 U12.CATH | U12.E 45.98,151.83 45.71,151.83 44.42,150.53 J10.7 41.77,152.47 v40.44,152.47 | U14.E 84.93,150.77 70.7,150.77 v68.2,153.27
N$57
  Top 0.406: C16.2 31.27,172.85 U10.CATH 31.55,166.84 32.92,166.84 34.37,165.4 34.37,163.35 32.92,161.9 31.55,161.9 U10.E
N$58  (via drill 0.35)
  Top 0.406: v29,148.97 29.45,149.42 R16.2 30.9,150.78 30.86,150.77 30.88,150.77 v32.8,148.84 | v39.2,153.17 38.95,152.92 C15.1
  Bottom 0.406: v29,148.97 18.63,148.97 18.16,148.5 16.74,148.5 15.73,149.51 15.73,150.12 U9.COLL | v32.8,148.84 32.8,154.59 24.27,163.13 24.27,167.58 24.92,168.23 31.73,168.23 34.37,165.59 34.37,160 39.45,154.92 | 39.45,154.92 39.2,154.67 v39.2,153.17 | J10.6 49.22,153.5 53.16,153.5 54.37,154.71 54.37,161.09 52.38,163.08 52.38,170.23 51.3,171.31 48.9,171.31 48.27,170.68 48.27,163.74 39.45,154.92
N$59  (via drill 0.35)
  Top 0.406: R19.2 37.3,163.67 v38.5,162.47 | v43.92,160.65 44.12,160.65 46.09,162.62 U12.A
  Bottom 0.406: v38.5,162.47 40.2,160.77 43.8,160.77 v43.92,160.65
N$60  (via drill 0.35)
  Top 0.406: R20.2 v65.19,174.18 v65.2,174.17
  Bottom 0.406: v65.2,174.17 68.73,170.64 U13.A
N$61
  Top 0.406: R21.2 75.5,170.22 75.5,165.85 U14.A
N$62  (via drill 0.35)
  Top 0.254: R35.2 71,27.22 C23.1
  Top 0.406: U16.COLL 78.3,20.94 R35.2 | C23.1 69.85,27.62 v69.1,28.37
  Bottom 0.406: v69.1,28.37 60.15,28.37 J11.5
N$63  (via drill 0.35)
  Top 0.254: v54.8,17.47 54.8,15.72 R36.2
  Top 0.406: J11.4 50.3,35.68 v50.3,35.17 | R36.2 52.95,12.47 C24.1 52.52,12.47 U17.CATH
  Bottom 0.406: v50.3,35.17 50.3,21.97 v54.8,17.47
N$64  (via drill 0.35)
  Top 0.406: J11.1 40.34,38.02 C27.1 20.95,38.02 v20.9,38.07 | v17.4,26.17 17.4,24.02 R39.2
  Bottom 0.406: v20.9,38.07 18.05,35.22 | 18.05,35.22 16.54,33.71 U20.COLL | 18.05,35.22 18.05,26.82 v17.4,26.17
N$65  (via drill 0.35)
  Top 0.406: C26.1 25.5,20.9 U19.COLL 25.86,20.86 26.83,21.83 29.91,21.83 34.45,26.37 R38.2 35.85,28.72 v36.2,29.07 | J11.2 39.1,32.82 v39.1,32.77
  Bottom 0.406: v39.1,32.77 36.2,29.87 v36.2,29.07
N$66  (via drill 0.35)
  Top 0.406: R37.2 C25.1 51.02,32.42 J11.3 | U18.COLL 39.35,14.32 v41.9,16.87
  Bottom 0.406: v41.9,16.87 41.9,27.87 46.13,32.1 J11.3
N$67
  Top 0.254: U15.A 87.77,26.19 R34.2
N$68
  Top 0.254: 65.88,18.36 65.88,29.3 R29.2
  Top 0.406: 65.88,18.36 65.85,18.12 70.2,13.77 71.14,13.77 U16.A
N$69  (via drill 0.35)
  Top 0.254: R38.1 37.65,26.27 R32.1 41.55,21.27 R31.1 47.35,15.47 R36.1 52.85,18.32 53.4,18.87 | R28.1 67.75,35.22 v66.6,34.07 | C28.1 71.2,34.22 R28.1 | R28.1 70.2,31.92 R29.1 | R34.1 81.45,24.37 81.45,27.17 79.82,28.8 78.52,28.8
  Top 0.406: J11.8 58.83,30.05 | 58.83,30.05 57.6,29.32 R37.1 | 58.83,30.05 58.83,20.79 | 58.83,20.79 R30.1 | 58.83,20.79 56.91,18.87 53.4,18.87 | R32.1 32.95,15.17 U19.CATH 26.55,14.17 24.1,14.17 22.4,15.87 22.4,17.8 U19.E 23.67,20.36 R39.1 21.76,24.55 21.75,24.57 R33.1 24.15,28.07 C26.2 | 78.52,28.8 R35.1 74.4,34.22 C28.1
  Bottom 0.406: v66.6,34.07 63.36,37.31 J11.8
N$70
  Top 0.406: U17.E 60.75,14.27 R30.2
N$71  (1 unrouted)
  Top 0.254: 72.3,35.92 70.94,35.92 70.87,36 65.48,36 C22.2 | C27.2 29.9,30.72 | C25.2 54.26,30.72 54.73,30.24 56.07,30.24 57.4,31.58 57.4,31.87 | U15.E 83.52,33.72 83.34,33.9
  Top 0.406: 57.4,31.87 57.4,36.2 J11.7 57,37.31 58.29,38.61 59.37,38.61 60.12,37.85 60.12,35.8 C22.2 | 29.9,30.72 C25.2 | 15.99,24.41 15.99,16.67 21.6,11.07 35.48,11.07 U18.E 39.63,6.92 39.63,5.55 41.08,4.1 43.12,4.1 44.57,5.55 44.57,6.92 U18.CATH | C24.2 49.55,11.9 U18.CATH | U18.CATH U17.A 55.53,6.92 55.53,5.55 56.98,4.1 59.02,4.1 60.47,5.55 60.47,6.92 U17.COLL | 72.3,35.92 C28.2 81.32,35.92 83.34,33.9 83.34,33.2 82.13,32 82.13,29.95 83.58,28.5 84.95,28.5 U15.CATH | C27.2 14.8,36.32 U20.E 11.91,33.43 10.54,33.43 9.09,31.98 9.09,29.94 10.54,28.49 11.91,28.49 U20.CATH
N$72
  Top 0.406: 72.41,21.81 71.2,21.81 69.76,20.37 69.76,18.32 70.73,17.35 U16.CATH | U16.E 74.22,20.84 73.25,21.81 72.41,21.81 | C23.2 72.41,21.81
N$73
  Top 0.254: C22.1 64.7,36.92 R28.2 73.25,36.92 73.6,37.27 84.73,37.27 85.69,36.3 85.69,35.8 U15.COLL
  Top 0.406: C22.1 60.68,36.94 60.68,38.08 59.6,39.17 56.31,39.17 54.46,37.31 J11.6
N$74
  Top 0.406: U18.A 44.85,13.97 R31.2
N$75
  Top 0.254: R32.2 31.65,16.97 U19.A
N$76
  Top 0.406: R33.2 14.87,28.07 U20.A
PWMA-3
  Top 0.254: MOTORDRIVER.23 53.84,58.14 52.8,59.17 49.5,59.17 48.74,59.93 J6.10
  Top 0.508: J6.10 48.74,64.14 NANO.6
PWMB-5
  Top 0.254: MOTORDRIVER.15 59.03,58.31 60.3,59.57 63.3,59.57 63.98,60.25 J6.4
  Top 0.406: NANO.12 63.93,61.55 J6.4
VCC  (via drill 0.35)
  Top 0.152: 23.7,76.57 23.6,76.67
  Top 0.254: 23.7,76.57 23.7,74.67 24.44,73.93
  Top 0.406: S2.1 27.64,57.67 27.64,69.23 26.14,70.73 26.14,72.23 24.44,73.93 23.6,74.77 23.6,76.67 23.6,78.44 U1.3 24.4,80.42 v24.4,83.07 24.4,82.77 | 36.1,82.37 J7.1 36.1,79.54 NANO.30 | J3.2 23.89,130.6 v23.79,130.5
  Bottom 0.406: v23.79,130.5 27.49,126.8 27.49,96.08 | v24.4,83.07 24.4,84.17 27.49,87.26 27.49,96.08 | 27.49,96.08 32,91.57 32,84.87 34.57,82.3 J7.1
VCC_1  (via drill 0.35)
  Top 0.254: MOTORDRIVER.24 53.19,57.37 | 53.19,57.37 53.19,55.99 | MOTORDRIVER.13 59.7,57.48 MOTORDRIVER.14 | 51.9,58.58 51.98,58.58 53.19,57.37 | 72.53,68.64 72.49,68.6 C4.1 65.3,68.31
  Top 0.305: 35.3,58.58 33.59,58.58 31.05,61.12
  Top 0.406: 59.7,57.48 59.7,55.77 59.3,55.37 57.1,55.37 56.44,56.04 MOTORDRIVER.19 MOTORDRIVER.20 55.78,56.06 55.2,55.47 53.7,55.47 53.19,55.99 MOTORDRIVER.24 53.08,57.48 51.98,58.58 | MOTORDRIVER.14 MOTORDRIVER.13 61.13,58.27 v66,58.27 | C4.1 72.58,68.6 72.9,68.92 | 72.9,68.92 C5.1 72.53,68.64 70.27,66.37 v68.1,66.37 | 72.9,68.92 73.71,68.11 C1.1 79.19,68.92 | 51.9,58.58 35.3,58.58 | U1.2 22.7,83.23 24.22,84.75 29.42,84.75 31.05,83.12 31.05,61.12
  Bottom 0.406: v68.1,66.37 74.9,66.37 76.5,64.77 76.5,60.57 74.1,58.17 66.1,58.17 v66,58.27
VCC_2  (via drill 0.35)  (2 unrouted)
  Top 0.254: 49.6,69.02 R3.2 | NANO.17 69.02,78.19 67.22,76.39 52.01,76.39 51.35,75.73 | 51.9,68.62 C6.1 51.45,68.87 | 55.3,70.77 59.1,70.77 | R2.2 49.12,67.25 49.15,67.27 49.15,68.27 49.75,68.87
  Top 0.406: U2.8 54.35,71.72 55.3,70.77 53.15,68.62 C6.1 49.7,68.62 R3.2 49.45,68.57 49.15,68.27 49.12,68.25 49.12,67.25 | U2.13 51.35,75.73 v52.1,76.48
  Top 0.508: J7.14 69.12,79.54 NANO.17
  Bottom 0.152: 53,76.37 52.89,76.48
  Bottom 0.254: 53.5,75.87 53,76.37
  Bottom 0.406: 52.89,76.48 v52.1,76.48 | 53.5,75.87 53.7,75.67 v53.7,71.72

### Text on the board
tNames: MICROMOUSE | CYBORG